# EAGLE schematic ESPREMOTE (EAGLE 9.3.1)
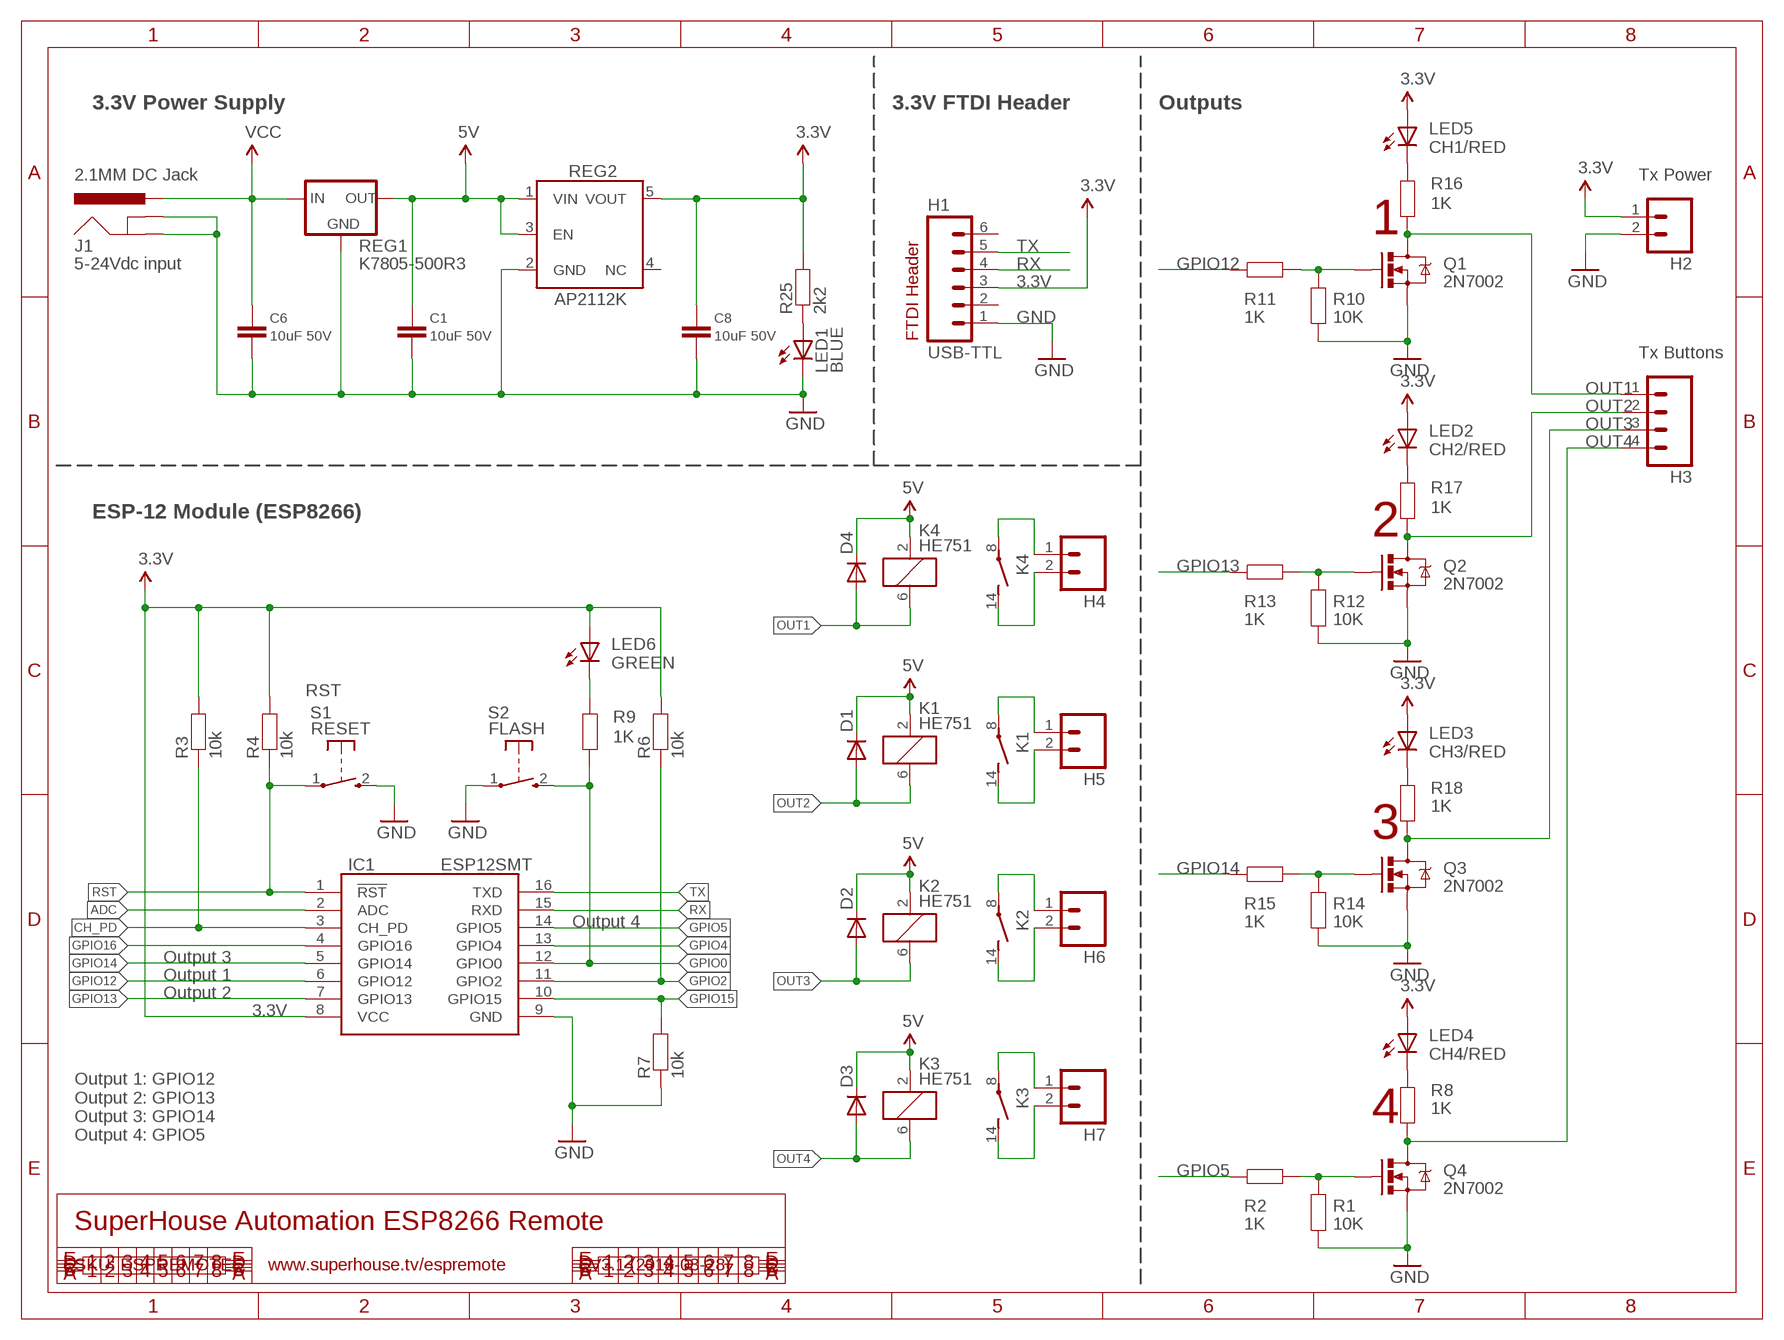
[diagram p0: schematic, sheet 1]

## Parts
C1  10uF 50V  C-EUC0805  [C0805]
C6  10uF 50V  C-EUC0805  [C0805]
C8  10uF 50V  C-EUC0805  [C0805]
D1  DIODESMA  [SMA-DIODE]
D2  DIODESMA  [SMA-DIODE]
D3  DIODESMA  [SMA-DIODE]
D4  DIODESMA  [SMA-DIODE]
H1  USB-TTL  M06SIP  [1X06]
H2  M02PTH  [1X02]
H3  M04PTH  [1X04]
H4  M02PTH  [1X02]
H5  M02PTH  [1X02]
H6  M02PTH  [1X02]
H7  M02PTH  [1X02]
IC1  ESP12SMT  [ESP12]
J1  2.1MM DC Jack  POWER_JACKPTH_SLOTS  [POWER_JACK_PTH_SLOTS]
K1  HE751  [HE751]
K2  HE751  [HE751]
K3  HE751  [HE751]
K4  HE751  [HE751]
LED1  BLUE  LED0603  [LED-0603]
LED2  CH2/RED  LED0603  [LED-0603]
LED3  CH3/RED  LED0603  [LED-0603]
LED4  CH4/RED  LED0603  [LED-0603]
LED5  CH1/RED  LED0603  [LED-0603]
LED6  GREEN  LED0603  [LED-0603]
Q1  2N7002  MOSFET-NCHANNELSMD  [SOT23-3]
Q2  2N7002  MOSFET-NCHANNELSMD  [SOT23-3]
Q3  2N7002  MOSFET-NCHANNELSMD  [SOT23-3]
Q4  2N7002  MOSFET-NCHANNELSMD  [SOT23-3]
R1  10K  RESISTOR0603  [0603]
R2  1K  RESISTOR0603  [0603]
R3  10k  RESISTOR0603  [0603]
R4  10k  RESISTOR0603  [0603]
R6  10k  RESISTOR0603  [0603]
R7  10k  RESISTOR0603  [0603]
R8  1K  RESISTOR0603  [0603]
R9  1K  RESISTOR0603  [0603]
R10  10K  RESISTOR0603  [0603]
R11  1K  RESISTOR0603  [0603]
R12  10K  RESISTOR0603  [0603]
R13  1K  RESISTOR0603  [0603]
R14  10K  RESISTOR0603  [0603]
R15  1K  RESISTOR0603  [0603]
R16  1K  RESISTOR0603  [0603]
R17  1K  RESISTOR0603  [0603]
R18  1K  RESISTOR0603  [0603]
R25  2k2  RESISTOR0603  [0603]
REG1  K7805-500R3  K78XX-500R3  [K78XX-500R3]
REG2  AP2112KSOT25  [SOT23-5]
S1  RESET  TAC_SWITCH_2PINSMT  [TACTILE_SWITCH_SMD_2PIN_TINY]
S2  FLASH  TAC_SWITCH_2PINSMT  [TACTILE_SWITCH_SMD_2PIN_TINY]

## Nets
3.3V: C8.1 H1.3 H2.1 IC1.8(VCC) LED2.A LED3.A LED4.A LED5.A LED6.A R3.2 R4.2 R6.2 R25.2 REG2.5(VOUT)
5V: C1.1 D1.C D2.C D3.C D4.C K1.2 K2.2 K3.2 K4.2 REG1.3(OUT) REG2.1(VIN) REG2.3(EN)
ADC: IC1.2(ADC)
CH_PD: IC1.3(CH_PD) R3.1
GND: C1.2 C6.2 C8.2 H1.1 H2.2 IC1.9(GND) J1.GND J1.GNDBREAK LED1.C Q1.2(S) Q2.2(S) Q3.2(S) Q4.2(S) R1.1 R7.1 R10.1 R12.1 R14.1 REG1.2(GND) REG2.2(GND) S1.2(S) S2.1(P)
GPIO0: IC1.12(GPIO0) R9.2 S2.2(S)
GPIO2: IC1.11(GPIO2) R6.1
GPIO4: IC1.13(GPIO4)
GPIO5: IC1.14(GPIO5) R2.2
GPIO12: IC1.6(GPIO12) R11.2
GPIO13: IC1.7(GPIO13) R13.2
GPIO14: IC1.5(GPIO14) R15.2
GPIO15: IC1.10(GPIO15) R7.2
GPIO16: IC1.4(GPIO16)
N$1: Q1.1(G) R10.2 R11.1
N$2: Q2.1(G) R12.2 R13.1
N$3: H5.1 K1.8(2:P)
N$4: LED3.C R18.1
N$5: H5.2 K1.14(2:S)
N$6: H6.1 K2.8(2:P)
N$7: Q4.1(G) R1.2 R2.1
N$8: H4.1 K4.8(2:P)
N$9: H6.2 K2.14(2:S)
N$10: Q3.1(G) R14.2 R15.1
N$11: LED4.C R8.1
N$12: H4.2 K4.14(2:S)
N$13: H7.1 K3.8(2:P)
N$14: H7.2 K3.14(2:S)
N$21: LED2.C R17.1
N$23: LED1.A R25.1
N$24: LED5.C R16.1
N$27: LED6.C R9.1
OUT1: D4.A H3.1 K4.6 Q1.3(D) R16.2
OUT2: D1.A H3.2 K1.6 Q2.3(D) R17.2
OUT3: D2.A H3.3 K2.6 Q3.3(D) R18.2
OUT4: D3.A H3.4 K3.6 Q4.3(D) R8.2
RST: IC1.1(!RST) R4.1 S1.1(P)
RX: H1.4 IC1.15(RXD)
TX: H1.5 IC1.16(TXD)
VCC: C6.1 J1.PWR REG1.1(IN)
Unconnected: H1.2 H1.6 REG2.4(NC)

## Notes on the sheet
- 3.3V Power Supply | 3.3V FTDI Header | Outputs
- Tx Power
- 1
- 5-24Vdc input
- FTDI Header
- Tx Buttons
- ESP-12 Module (ESP8266)
- 2
- 3
- Output 4
- Output 3
- Output 1
- Output 2
- 4
- Output 1: GPIO12
  Output 2: GPIO13
  Output 3: GPIO14
  Output 4: GPIO5
- SuperHouse Automation ESP8266 Remote
- SKU: ESPREMOTE | www.superhouse.tv/espremote | V3.1 (2018-03-28)

## Library data of the parts
C1 C6 C8 = freetronics-jon:C-EU: CAPACITOR, European symbol
D1-D4 = SparkFun:DIODE: Diode These are standard reverse protection diodes and small signal diodes. SMA package can handle up to about 1A. SOD-323 can handle about 200mA. What the SOD-323 package when ordering, there are some mfgs out there that are 5-pin packages.
H1 = freetronics:M06: Header 6 Standard 6-pin 0.1" header. Use with straight break away headers (SKU : PRT-00116), right angle break away headers (PRT-00553), swiss pins (PRT-00743), machine pins (PRT-00117), and female headers (PRT-00115). Molex polarized connector foot print use with SKU : PRT-08094 with associated crimp pins and housings. NOTES ON THE VARIANTS LOCK and LOCK_LONGPADS... This footprint was designed to help hold the alignment of a through-hole component (i.e. 6-pin header) while soldering it into place. You may notice that each hole has been shifted either up or down by 0.005 of an inch from it's more standard position (which is a perfectly straight line). This slight alteration caused the pins (the squares in the middle) to touch the edges of the holes. Because they are alternating, it causes a "brace" to hold the component in place. 0.005 has proven to be the perfect amount of "off-center" position when using our standard breakaway headers. Although looks a little odd when you look at the bare footprint, once you have a header in there, the alteration is very hard to notice. Also, if you push a header all the way into place, it is covered up entirely on the bottom side. This idea of altering the position of holes to aid alignment will be further integrated into the Sparkfun Library for other footprints. It can help hold any component with 3 or more connection pins.
H2 H4-H7 = freetronics-jon:M02: Header 2 Standard 2-pin 0.1" header. Use with straight break away headers (SKU : PRT-00116), right angle break away headers (PRT-00553), swiss pins (PRT-00743), machine pins (PRT-00117), and female headers (PRT-00115). Molex polarized connector foot print use with SKU : PRT-08233 with associated crimp pins and housings.
H3 = freetronics-jon:M04: Header 4 Standard 4-pin 0.1" header. Use with straight break away headers (SKU : PRT-00116), right angle break away headers (PRT-00553), swiss pins (PRT-00743), machine pins (PRT-00117), and female headers (PRT-00115). Molex polarized connector foot print use with SKU : PRT-08231 with associated crimp pins and housings. 1MM SMD Version SKU: PRT-10208
IC1 = freetronics-jon:ESP12
J1 = freetronics-jon:POWER_JACK: Power Jack This is the standard 5.5mm barrel jack for power. The PTH is the most common, proven, reliable, footprint. All others are experimental. The Slot footprint only works if the mill layer is transmitted to the PCB fab house so be warned. Spark Fun Electronics SKU : PRT-00119. Mating wall wart : TOL-00298 (and others)
K1-K4 = relay:HE751: RELAY reed, 1 x norm. open, Hamlin
LED1 = freetronics-jon:LED: LEDs Standard schematic elements and footprints for 5mm, 3mm, 1206, and 0603 sized LEDs. 5mm - Spark Fun Electronics SKU : COM-00529 (and others)
LED2-LED6 = freetronics-master-v1:LED: LEDs Standard schematic elements and footprints for 5mm, 3mm, 1206, and 0603 sized LEDs. 5mm - Spark Fun Electronics SKU : COM-00529 (and others)
Q1-Q4 = freetronics-master-v1:MOSFET-NCHANNEL
R1 R2 R8-R18 = freetronics-master-v1:RESISTOR: Resistor Basic schematic elements and footprints for 0603, 1206, and PTH 1/10th watt (small) resistors.
R3 R4 R6 R7 R25 = freetronics-jon:RESISTOR: Resistor Basic schematic elements and footprints for 0603, 1206, and PTH 1/10th watt (small) resistors.
REG1 = freetronics-jon:K78XX-500R3
REG2 = freetronics-jon:AP2112K: AP2112K LDO linear voltage regulator
S1 S2 = freetronics-jon:TAC_SWITCH_2PIN: Momentary Tactile Switch - 2 pin

## Net classes
0 default: width 0.203 mm, drill 0.356 mm, clearance 0.152 mm
1 power: width 0.203 mm, clearance 0.152 mm